# Altium project cameraFor4G.PrjPCB
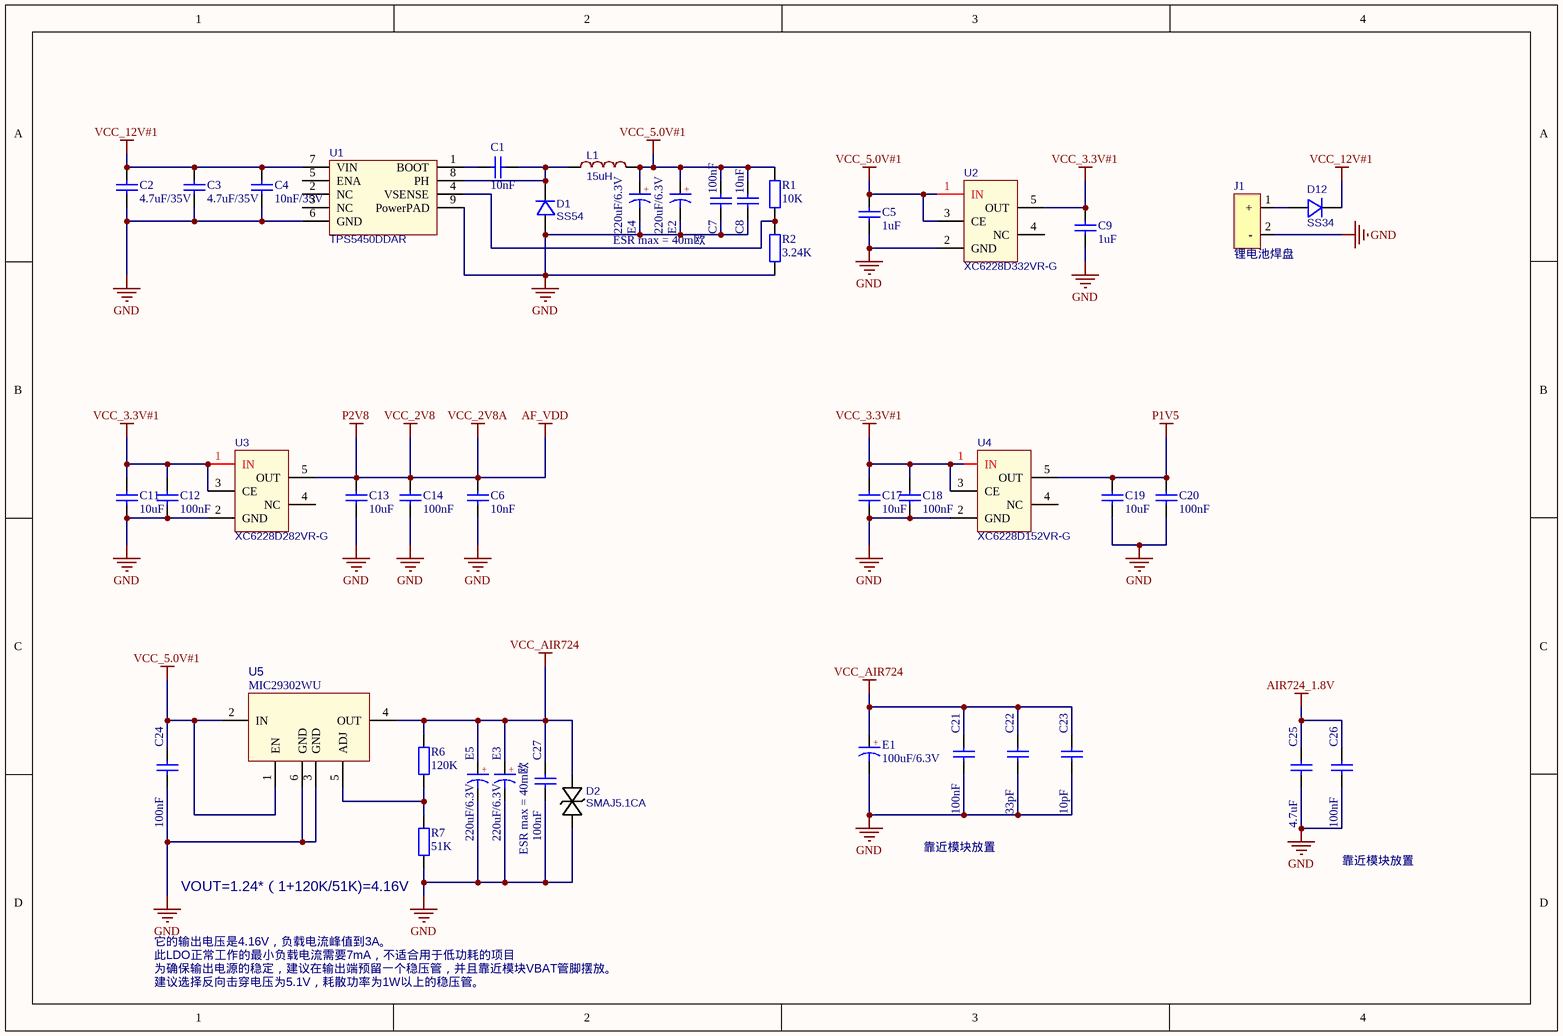
[diagram p0: 00_POWER.SchDoc]
5 sheets, 132 parts. Net scope: global (net labels, ports and power ports of the same name join across sheets).
Board file: cameraBoard.PcbDoc
Sheets:
  00_POWER.SchDoc
  01_MCU.SchDoc
  02_MCU_PERIPHERAL.SchDoc
  03_AIR724.SchDoc
  04_AIR724_PERIPHERAL.SchDoc

## Sheet 00_POWER.SchDoc
size A4

### Parts
C1  10nF  [0603-C]
C2  4.7uF/35V  [0805-C]
C3  4.7uF/35V  [0805-C]
C4  10nF/35V  [0603-C]
C5  1uF  [0603-C]
C6  10nF  [0603-C]
C7  100nF  [0603-C]
C8  10nF  [0603-C]
C9  1uF  [0603-C]
C11  10uF  [0603-C]
C12  100nF  [0603-C]
C13  10uF  [0603-C]
C14  100nF  [0603-C]
C17  10uF  [0603-C]
C18  100nF  [0603-C]
C19  10uF  [0603-C]
C20  100nF  [0603-C]
C21  100nF  [0603-C]
C22  33pF  [0603-C]
C23  10pF  [0603-C]
C24  100nF  [0603-C]
C25  4.7uF  [0603-C]
C26  100nF  [0603-C]
C27  100nF  [0603-C]
D1  SS54  [SS34-SMA]
D2  SMAJ5.1CA  [ZENER]
D12  SS34  [SS34-SMA]
E1  100uF/6.3V  [CD B(3528)]
E2  220uF/6.3V  [CD B(3528)]
E3  220uF/6.3V  [CD B(3528)]
E4  220uF/6.3V  [CD B(3528)]
E5  220uF/6.3V  [CD B(3528)]
J1  锂电池焊盘  [锂电池焊盘]
L1  15uH  [电感7*7*3]
R1  10K  [0603-R]
R2  3.24K  [0603-R]
R6  120K  [0603-R]
R7  51K  [0603-R]
U1  TPS5450DDAR  [TPS5430]
U2  XC6228D332VR-G  [XC6228D332VR-G]
U3  XC6228D282VR-G  [XC6228D332VR-G]
U4  XC6228D152VR-G  [XC6228D332VR-G]
U5  MIC29302WU  [MIC29302WU]

### Nets
AF_VDD: C6.2 C13.2 C14.2 U3.5(OUT)  [also labelled P2V8, VCC_2V8, VCC_2V8A]
AIR724_1.8V: C25.2 C26.2
GND: C2.2 C3.2 C4.1 C5.1 C6.1 C7.2 C8.2 C9.1 C11.1 C12.1 C13.1 C14.1 C17.1 C18.1 C19.1 C20.1 C21.1 C22.1 C23.1 C24.1 C25.1 C26.1 C27.1 D1.1(+) D2.2(A) E1.2(K) E2.2(K) E3.2(K) E4.2(K) E5.2(K) J1.2(-) R2.2 R7.2 U1.6(GND) U1.9(PowerPAD) U2.2(GND) U3.2(GND) U4.2(GND) U5.3(GND) U5.6(GND)
P1V5: C19.2 C20.2 U4.5(OUT)
VCC_3.3V#1: C9.2 C11.2 C12.2 C17.2 C18.2 U2.5(OUT) U3.1(IN) U3.3(CE) U4.1(IN) U4.3(CE)
VCC_5.0V#1: C5.2 C7.1 C8.1 C24.2 E2.1(A) E4.1(A) L1.2 R1.1 U2.1(IN) U2.3(CE) U5.1(EN) U5.2(IN)
VCC_12V#1: C2.1 C3.1 C4.2 D12.2(-) U1.7(VIN)
VCC_AIR724: C21.2 C22.2 C23.2 C27.2 D2.1(C) E1.1(A) E3.1(A) E5.1(A) R6.1 U5.4(OUT)
NetC1_1: C1.1 D1.2(-) L1.1 U1.8(PH)
NetC1_2: C1.2 U1.1(BOOT)
NetD12_1: D12.1(+) J1.1(+)
NetR1_2: R1.2 R2.1 U1.4(VSENSE)
NetR6_2: R6.2 R7.1 U5.5(ADJ)

Not connected (* = marked no-connect by the designer): U1 2(NC) 3(NC) 5(ENA); U2 4(NC); U3 4(NC); U4 4(NC)

### Notes on the sheet
- ESR max = 40m欧
- 靠近模块放置
- (near R7) VOUT=1.24*（1+120K/51K)=4.16V
- 它的输出电压是4.16V，负载电流峰值到3A。
- 为确保输出电源的稳定，建议在输出端预留一个稳压管，并且靠近模块VBAT管脚摆放。
- 建议选择反向击穿电压为5.1V，耗散功率为1W以上的稳压管。
- 此LDO正常工作的最小负载电流需要7mA，不适合用于低功耗的项目
- (in symbol CT) +

### Library data of the parts
C1-C9 C11-C14 C17-C27 = C: 贴片电容; BOM名称: 无极性贴片电容; 联系卖家，免费查找封装: 唯一出售店铺网址https://shop463601444.taobao.com
D1 D12 = SS34: BOM_Manufacturer: Wuxi ARK Tech Elec; BOM_Manufacturer Part: D-G060306G1-KS2; Contributor: LCSC; BOM_Supplier: LCSC; BOM_Supplier Part: C118334; BOM_JLCPCB Part Class: Extended Part; spicePre: L; spiceSymbolName: D-G060306G1-KS2
D2 = SMAJ6.0CA: SMAJ6.0CA_C698928; BOM_Manufacturer: Yangzhou Yangjie Elec Tech; Contributor: LCSC; BOM_Supplier: LCSC; BOM_Supplier Part: C698928; BOM_Manufacturer Part: SMAJ6.0CA; BOM_JLCPCB Part Class: Extended Part; spicePre: D; spiceSymbolName: SMAJ6.0CA_C698928
E1-E5 = CT: 贴片钽电容; 联系卖家，免费查找封装: 唯一出售店铺网址https://shop463601444.taobao.com; BOM名称: 贴片钽电容
L1 = L: BOM_Manufacturer: Sunlord; BOM_Manufacturer Part: UPZ2012D800-4R0TF; nameAlias: Value; Contributor: LCSC; BOM_Supplier: LCSC; BOM_Supplier Part: C145060; BOM_JLCPCB Part Class: Extended Part; spicePre: L; spiceSymbolName: UPZ2012D800-4R0TF
R1 R2 R6 R7 = R: 贴片电阻; 联系卖家，免费查找封装: 唯一出售店铺网址https://shop463601444.taobao.com; BOM名称: 贴片电阻
U1 = TPS5430DDAR: BOM_Manufacturer: TI; BOM_Supplier: LCSC; BOM_Manufacturer Part: TPS5430DDAR; BOM_Supplier Part: C9864; BOM_JLCPCB Part Class: Basic Part; spicePre: U; spiceSymbolName: TPS5430DDAR
U2 = XC6228D332VR-G: 输出类型：固定 输出极性：正 输出通道数：1 最大输入电压：5.5V 输出电压：3.3V 压差：305mV@(300mA) 输出电流：300mA 电源纹波抑制比(PSRR)：80dB@(1kHz) 3.3V固定输出，Iout=300mA，Vin=5.5V(Max); BOM_Manufacturer: TOREX; BOM_Supplier: LCSC; BOM_Manufacturer Part: XC6228D332VR-G; BOM_Supplier Part: C69841; BOM_JLCPCB Part Class: Extended Part; spicePre: U; spiceSymbolName: XC6228D332VR-G
U3 U4 = XC6228D282VR-G: 输出类型：固定 输出极性：正 输出通道数：1 最大输入电压：5.5V 输出电压：2.8V 压差：305mV@(300mA) 输出电流：300mA 电源纹波抑制比(PSRR)：80dB@(1kHz) 3.3V固定输出，Iout=300mA，Vin=5.5V(Max); BOM_Manufacturer: TOREX; BOM_Supplier: LCSC; BOM_Manufacturer Part: XC6228D332VR-G; BOM_Supplier Part: C69841; BOM_JLCPCB Part Class: Extended Part; spicePre: U; spiceSymbolName: XC6228D332VR-G
U5 = MIC29302WU: Manufacturer: UMW(友台半导体); Symbol: MIC29302WU_C2995533; Add into BOM: yes; Name: MIC29302WU; Device: MIC29302WU; LCSC Part Name: 3A Fast-Response LDO Regulator; Supplier Part: C2995533; Manufacturer Part: MIC29302WU; Supplier Footprint: TO-263; JLCPCB Part Class: Extended Part; Datasheet: https://atta.szlcsc.com/upload/public/pdf/source/20220414/64A379364ACD2069C59BD188E91B8798.pdf; Supplier: LCSC; Convert to PCB: yes

## Sheet 01_MCU.SchDoc
size A4
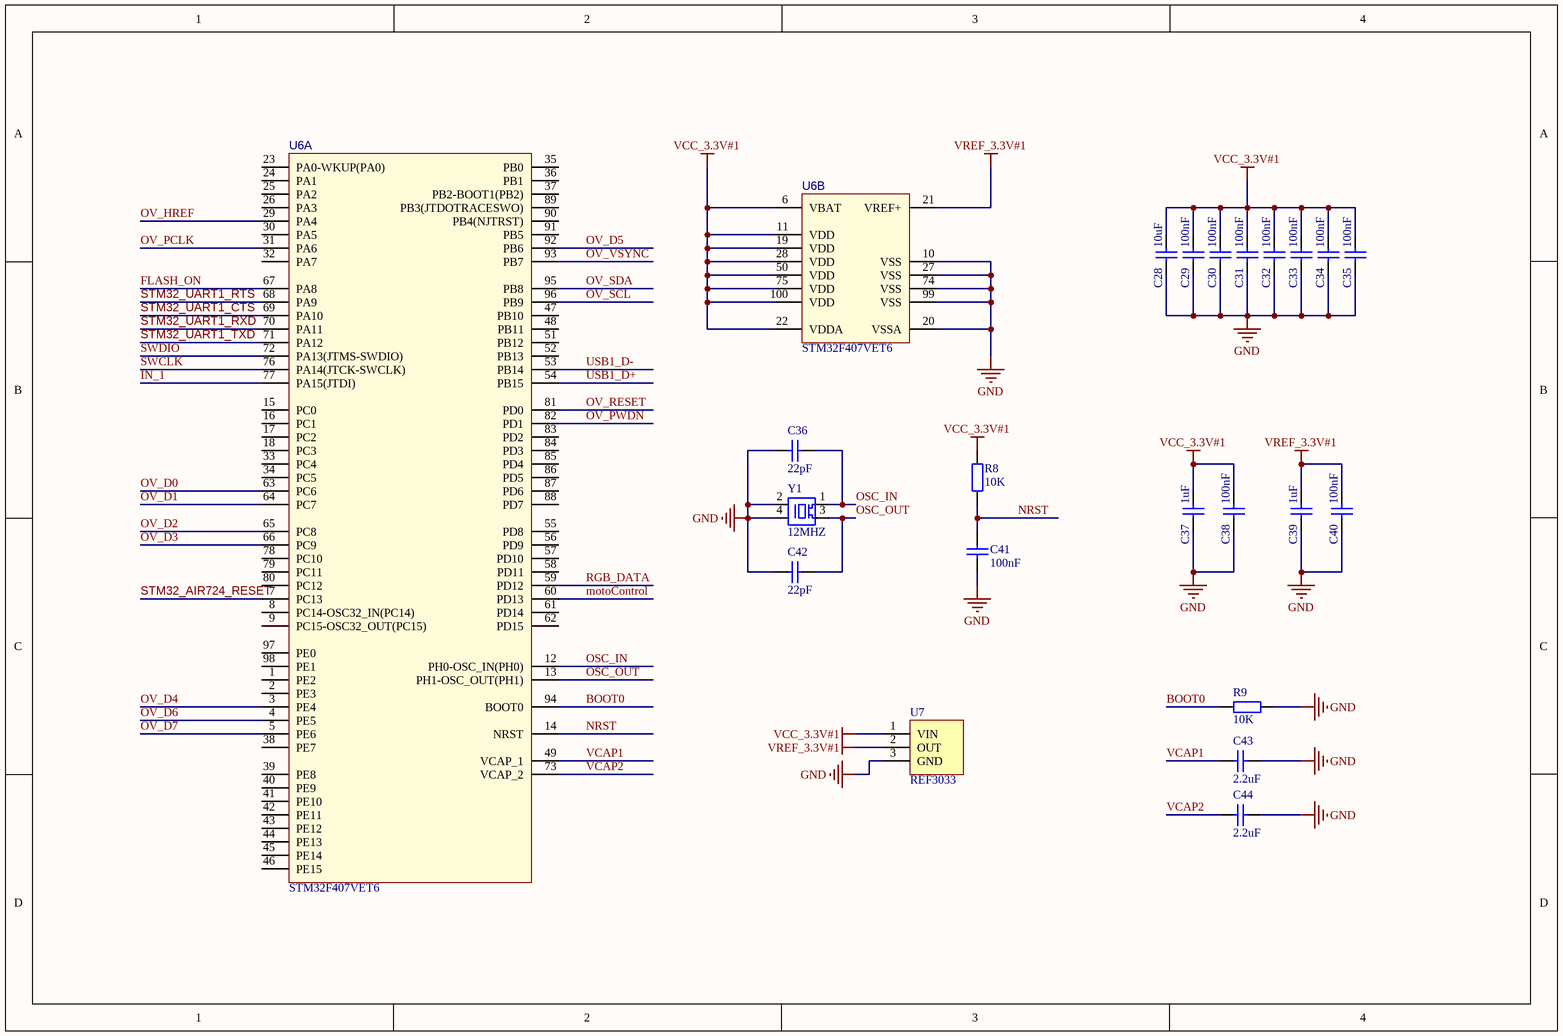
[diagram p1: 01_MCU.SchDoc]

### Parts
C28  10uF  [0603-C]
C29  100nF  [0603-C]
C30  100nF  [0603-C]
C31  100nF  [0603-C]
C32  100nF  [0603-C]
C33  100nF  [0603-C]
C34  100nF  [0603-C]
C35  100nF  [0603-C]
C36  22pF  [0603-C]
C37  1uF  [0603-C]
C38  100nF  [0603-C]
C39  1uF  [0603-C]
C40  100nF  [0603-C]
C41  100nF  [0603-C]
C42  22pF  [0603-C]
C43  2.2uF  [0603-C]
C44  2.2uF  [0603-C]
R8  10K  [0603-R]
R9  10K  [0603-R]
U6  STM32F407VET6  [STM32F407VET6]  (parts A,B of 2)
U7  REF3033  [REF3033]
Y1  12MHZ  [3225]

### Nets
GND: C28.1 C29.1 C30.1 C31.1 C32.1 C33.1 C34.1 C35.1 C36.1 C37.1 C38.1 C39.1 C40.1 C41.1 C42.1 C43.2 C44.2 R9.1 U6.10(VSS) U6.20(VSSA) U6.27(VSS) U6.74(VSS) U6.99(VSS) U7.3(GND) Y1.2(GND) Y1.4(GND)
VCC_3.3V#1: C28.2 C29.2 C30.2 C31.2 C32.2 C33.2 C34.2 C35.2 C37.2 C38.2 R8.2 U6.6(VBAT) U6.11(VDD) U6.19(VDD) U6.22(VDDA) U6.28(VDD) U6.50(VDD) U6.75(VDD) U6.100(VDD) U7.1(VIN)
VREF_3.3V#1: C39.2 C40.2 U6.21(VREF+) U7.2(OUT)
BOOT0: R9.2 U6.94(BOOT0)
FLASH_ON: U6.67(PA8)
IN_1: U6.77(PA15(JTDI))
motoControl: U6.60(PD13)
NRST: C41.2 R8.1 U6.14(NRST)
OSC_IN: C36.2 U6.12(PH0-OSC_IN(PH0)) Y1.1(XTAL1)
OSC_OUT: C42.2 U6.13(PH1-OSC_OUT(PH1)) Y1.3(XTAL3)
OV_D0: U6.63(PC6)
OV_D1: U6.64(PC7)
OV_D2: U6.65(PC8)
OV_D3: U6.66(PC9)
OV_D4: U6.3(PE4)
OV_D5: U6.92(PB6)
OV_D6: U6.4(PE5)
OV_D7: U6.5(PE6)
OV_HREF: U6.29(PA4)
OV_PCLK: U6.31(PA6)
OV_PWDN: U6.82(PD1)
OV_RESET: U6.81(PD0)
OV_SCL: U6.96(PB9)
OV_SDA: U6.95(PB8)
OV_VSYNC: U6.93(PB7)
RGB_DATA: U6.59(PD12)
STM32_AIR724_RESET: U6.7(PC13)
STM32_UART1_CTS: U6.69(PA10)
STM32_UART1_RTS: U6.68(PA9)
STM32_UART1_RXD: U6.70(PA11)
STM32_UART1_TXD: U6.71(PA12)
SWCLK: U6.76(PA14(JTCK-SWCLK))
SWDIO: U6.72(PA13(JTMS-SWDIO))
USB1_D+: U6.54(PB15)
USB1_D-: U6.53(PB14)
VCAP1: C43.1 U6.49(VCAP_1)
VCAP2: C44.1 U6.73(VCAP_2)

Not connected (* = marked no-connect by the designer): U6 1(PE2) 2(PE3) 8(PC14-OSC32_IN(PC14)) 9(PC15-OSC32_OUT(PC15)) 15(PC0) 16(PC1) 17(PC2) 18(PC3) 23(PA0-WKUP(PA0)) 24(PA1) 25(PA2) 26(PA3) 30(PA5) 32(PA7) 33(PC4) 34(PC5) 35(PB0) 36(PB1) 37(PB2-BOOT1(PB2)) 38(PE7) 39(PE8) 40(PE9) 41(PE10) 42(PE11) 43(PE12) 44(PE13) 45(PE14) 46(PE15) 47(PB10) 48(PB11) 51(PB12) 52(PB13) 55(PD8) 56(PD9) 57(PD10) 58(PD11) 61(PD14) 62(PD15) 78(PC10) 79(PC11) 80(PC12) 83(PD2) 84(PD3) 85(PD4) 86(PD5) 87(PD6) 88(PD7) 89(PB3(JTDOTRACESWO)) 90(PB4(NJTRST)) 91(PB5) 97(PE0) 98(PE1)

### Library data of the parts
C28-C44 = C: as C1 on sheet 00_POWER
R8 R9 = R: as R1 on sheet 00_POWER; BOM名称: 贴片电阻
U6 = STM32F407VET6: Manufacturer: ST(意法半导体); Add into BOM: yes; CPU Core: ARM Cortex-M4; CPU Maximum Speed: 168MHz; Operating Voltage Range: 1.8V~3.6V; Program Storage Size: 512KB; Program Memory Type: FLASH; RAM Size: 192KB; GPIO Ports Number: 82; ADC (Bit): 12bit; Universal Serial Bus: 有; Peripheral/Function: DMA；LCD/LED驱动；PWM; tags: STM32; Name: STM32F407VET6; Symbol: STM32F407VET6; Device: STM32F407VET6; LCSC Part Name: STM32F407VET6; Supplier Part: C28730; Manufacturer Part: STM32F407VET6; Supplier Footprint: LQFP-100(14x14); JLCPCB Part Class: Extended Part; Datasheet: https://atta.szlcsc.com/upload/public/pdf/source/20140801/1457707197138.pdf; Supplier: LCSC; Convert to PCB: yes; EEPROM: -; DAC (Bit): 12bit; PWM (Bit): -; Internal Comparator: -; communication protocol: -; Watchdog: 有; Real-Time Clock: -; Infrared Data Association: 有; Low-Voltage Detect: 有; CCP Capture/Compare: -; LCD Module: 有; Secure Digital Input and Output: -; Direct Memory Access: 有; Internal Oscillator: 有; Operating Temperature Range: -40℃~+85℃; image: http://image.lceda.cn/szlcsc/C28730.jpg
Y1 = Y: 无源晶振

## Sheet 02_MCU_PERIPHERAL.SchDoc
size A4
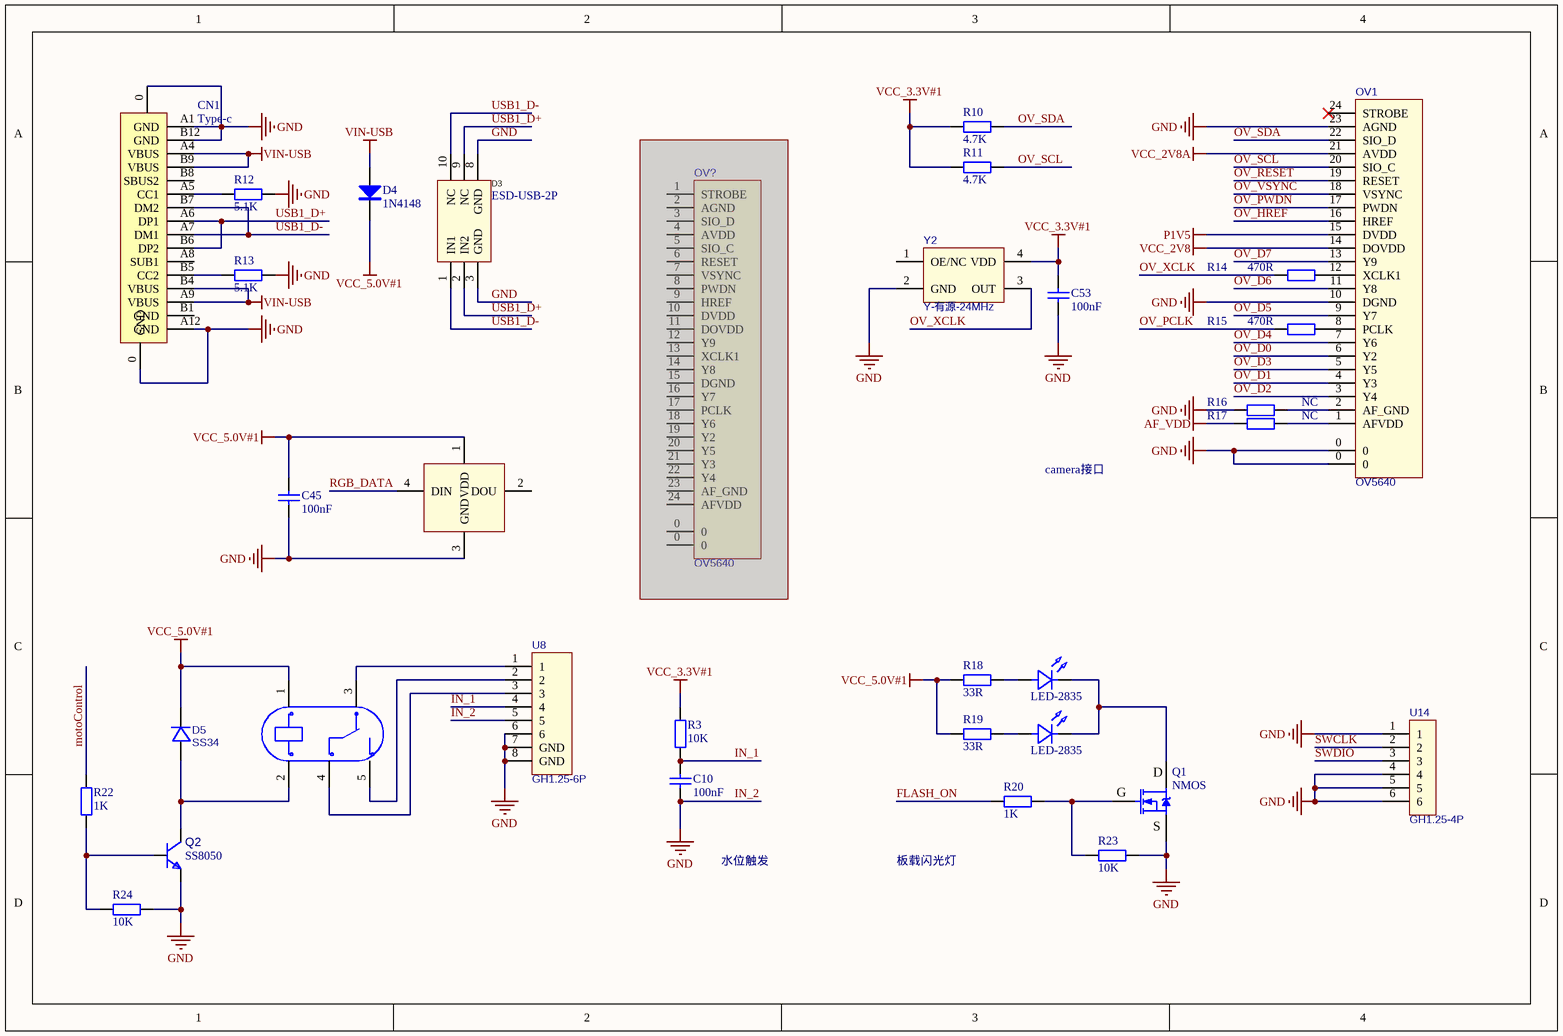
[diagram p2: 02_MCU_PERIPHERAL.SchDoc]

### Parts
C10  100nF  [0603-C]
C45  100nF  [0603-C]
C53  100nF  [0603-C]
CN1  Type-c  [Type-c 16pin]
D3  ESD-USB-2P  [SLP2510P8-2P]
D4  1N4148  [1N4148W]
D5  SS34  [SS34-SMA]
K1  JQC-3FF/005-1ZS(551)  [RELAY-TH_HF3FF-XX-1ZXX-XXX]  (value not drawn)
LED1  WS2812B-5050  [WS2812B-5050]  (value not drawn)
OV1  OV5640  [FPC-SMD_P0.50-24P_XJ-FGS]
OV?  OV5640  [FPC-SMD_P0.50-24P_XJ-FGS]  (masked out: inside a compile mask, not in the netlist)
Q1  NMOS  [AO3400]
Q2  SS8050  [SOT23-3M]
R3  10K  [0603-R]
R10  4.7K  [0603-R]
R11  4.7K  [0603-R]
R12  5.1K  [0603-R]
R13  5.1K  [0603-R]
R14  470R  [0603-R]
R15  470R  [0603-R]
R16  NC  [0603-R]
R17  NC  [0603-R]
R18  33R  [1206-R]
R19  33R  [1206-R]
R20  1K  [0603-R]
R22  1K  [0603-R]
R23  10K  [0603-R]
R24  10K  [0603-R]
U8  GH1.25-6P  [CONN-SMD_A1257WR-S-6P]
U9  LED-2835  [LED-SMD_L3.5-W2.8-FD-2835_WHITE]
U10  LED-2835  [LED-SMD_L3.5-W2.8-FD-2835_WHITE]
U14  GH1.25-4P  [CONN-SMD_GH1.25-4PWBPZ]
Y2  Y-有源-24MHz  [3225]

### Nets
AF_VDD: OV1.14(DOVDD) OV1.21(AVDD) R17.2  [also labelled VCC_2V8, VCC_2V8A]
GND: C10.1 C45.1 C53.1 CN1.0(GND) CN1.A1(GND) CN1.A12(GND) CN1.B12(GND) D3.3(GND) D3.8(GND) LED1.3(GND) OV1.0 OV1.10(DGND) OV1.23(AGND) Q1.2(S) Q2.2(E) R12.2 R13.2 R16.2 R23.1 R24.1 U8.5 U8.6 U8.7(GND) U8.8(GND) U14.1 U14.4 U14.5 U14.6 Y2.2(GND)  [also labelled IN_2]
P1V5: OV1.15(DVDD)
VCC_3.3V#1: C53.2 R3.2 R10.2 R11.2 Y2.4(VDD)
VCC_5.0V#1: C45.2 D4.2(K) D5.2(-) K1.1 LED1.1(VDD) R18.2 R19.2
VIN-USB: CN1.A4(VBUS) CN1.A9(VBUS) CN1.B4(VBUS) CN1.B9(VBUS) D4.1(A)
FLASH_ON: R20.2
IN_1: C10.2 R3.1 U8.4
motoControl: R22.2
OV_D0: OV1.6(Y2)
OV_D1: OV1.4(Y3)
OV_D2: OV1.3(Y4)
OV_D3: OV1.5(Y5)
OV_D4: OV1.7(Y6)
OV_D5: OV1.9(Y7)
OV_D6: OV1.11(Y8)
OV_D7: OV1.13(Y9)
OV_HREF: OV1.16(HREF)
OV_PCLK: R15.2
OV_PWDN: OV1.17(PWDN)
OV_RESET: OV1.19(RESET)
OV_SCL: OV1.20(SIO_C) R11.1
OV_SDA: OV1.22(SIO_D) R10.1
OV_VSYNC: OV1.18(VSYNC)
OV_XCLK: R14.2 Y2.3(OUT)
RGB_DATA: LED1.4(DIN)
SWCLK: U14.2
SWDIO: U14.3
USB1_D+: CN1.A6(DP1) CN1.B6(DP2) D3.2(IN2) D3.9(NC)
USB1_D-: CN1.A7(DM1) CN1.B7(DM2) D3.1(IN1) D3.10(NC)
NetCN1_A5: CN1.A5(CC1) R12.1
NetCN1_B5: CN1.B5(CC2) R13.1
NetD5_1: D5.1(+) K1.2 Q2.3(C)
NetK1_3: K1.3 U8.1
NetK1_4: K1.4 U8.3
NetK1_5: K1.5 U8.2
NetOV1_1: OV1.1(AFVDD) R17.1
NetOV1_2: OV1.2(AF_GND) R16.1
NetOV1_8: OV1.8(PCLK) R15.1
NetOV1_12: OV1.12(XCLK1) R14.1
NetQ1_1: Q1.1(G) R20.1 R23.2
NetQ1_3: Q1.3(D) U9.1(K) U10.1(K)
NetQ2_1: Q2.1(B) R22.1 R24.2
NetR18_1: R18.1 U9.2(A)
NetR19_1: R19.1 U10.2(A)

Not connected (* = marked no-connect by the designer): CN1 A8(SUB1) B1(GND) B8(SBUS2); LED1 2(DOU); OV1 24(STROBE)*; Y2 1(OE/NC)

### Notes on the sheet
- camera接口
- 水位触发
- 板载闪光灯

### Library data of the parts
C10 C45 C53 = C: as C1 on sheet 00_POWER
CN1 = Type-c: U262-161N-4BVC11
D3 = ESD-USB-2P: RClamp0522PATCT; Manufacturer: SEMTECH; Name: RClamp0524PATCT; Device: RClamp0524PATCT_C40960; Add into BOM: yes; Reverse Stand-Off Voltage (Vrwm): 5V; Breakdown Voltage (VBR): 6V; Clamping Voltage@Ipp: 15V; Peak Pulse Power(Ppp)@8/20us: 150W; Junction Capacitance(Cj)@1MHz: 0.8pF@1MHz; Symbol: RClamp0524PATCT; LCSC Part Name: RClamp0524PATCT; Supplier Part: C40960; Manufacturer Part: RClamp0524PATCT; Supplier Footprint: SLP2510P8; JLCPCB Part Class: Extended Part; Datasheet: https://atta.szlcsc.com/upload/public/pdf/source/20150124/1457707260739.pdf; Supplier: LCSC; Convert to PCB: yes; Operating Temperature: -55℃~+125℃@(Tj)
D4 = 1N4148W: 整流二极管; 版权归属: 源创客; BOM名称: 整流二极管; 学习资源: www.ooocke.com
D5 = SS34: as D1 on sheet 00_POWER; BOM_Supplier: LCSC; BOM_Supplier Part: C118334; BOM_JLCPCB Part Class: Extended Part; spicePre: L; spiceSymbolName: D-G060306G1-KS2
K1 = JQC-3FF/005-1ZS(551): Manufacturer: HF(宏发); Symbol: JQC-3FF/05-1ZS(551); Add into BOM: yes; Coil Voltage: 5V; Coil Type: 非极化-单线圈; Pin Number: 5; Contact Form: 一组转换:1C(单刀双掷-转换); Maximum Switching Current: 10A; Maximum Switching Voltage: 277V@AC；30V@DC; Coil Rated Power: 360mW; Contact Rating: 10A@28VDC；10A@277VAC; Coil Resistance: 70Ω; Operate Time: 10ms; Release Time: 5ms; Contact Resistance: 100mΩ; Name: JQC-3FF/005-1ZS(551); Device: JQC-3FF/005-1ZS(551); LCSC Part Name: 超小型大功率5V继电器 单刀双掷; Supplier Part: C9221; Manufacturer Part: JQC-3FF/005-1ZS(551); Supplier Footprint: 插件,15.5x19mm; JLCPCB Part Class: Extended Part; Datasheet: https://atta.szlcsc.com/upload/public/pdf/source/20210906/31FD0911648F640D4227475E890A46EB.pdf; Supplier: LCSC; Convert to PCB: yes; Contact Material: AgCdO; Operating Temperature: -40℃~+85℃
LED1 = WS2812B-5050: Manufacturer: XINGLIGHT(成兴光); Name: XL-5050RGBC-WS2812B; Add into BOM: yes; Emitted Color: RGB三色; Lens Color: 无色透明; Peak Wavelength: 625nm；470nm；530nm; Viewing Angle: 120°; Mounting Sytle: 正贴; Symbol: XL-5050RGBC-WS2812B; Device: XL-5050RGBC-WS2812B; LCSC Part Name: RGB三色 正贴 幻彩; Supplier Part: C2843785; Manufacturer Part: XL-5050RGBC-WS2812B; Supplier Footprint: SMD5050; JLCPCB Part Class: Extended Part; Datasheet: https://atta.szlcsc.com/upload/public/pdf/source/20230111/86AAD2096485A2E5BCAB883FF8CBE6FD.pdf; Supplier: LCSC; Convert to PCB: yes; Diode Configuration: -; Dominant Wavelength: -; Color Temperature: -; Forward Current: -; Power Dissipation: -; Operating Temperature: -30℃~+70℃
OV1 = OV5640_BACK: BOM_Manufacturer: Shenzhen Cankemeng; Contributor: LCSC; BOM_Supplier: LCSC; BOM_Supplier Part: C132514; BOM_Manufacturer Part: -; BOM_JLCPCB Part Class: Extended Part; spicePre: F; spiceSymbolName: FPC0.5-24P
OV? = OV5640: BOM_Manufacturer: Shenzhen Cankemeng; Contributor: LCSC; BOM_Supplier: LCSC; BOM_Supplier Part: C132514; BOM_Manufacturer Part: -; BOM_JLCPCB Part Class: Extended Part; spicePre: F; spiceSymbolName: FPC0.5-24P
Q1 = AO3400: N沟道 30V/4.2A; BOM名称: 场效应管; 联系卖家，免费查找封装: 唯一出售店铺网址https://shop463601444.taobao.com; 参数: N沟道 30V/4.2A
R3 R10-R20 R22-R24 = R: as R1 on sheet 00_POWER; BOM名称: 贴片电阻
U8 = GH1.25-6P: GH1.25-4PWBPZ; BOM_Manufacturer: BOOMELE(博穆精密); Contributor: LCSC; BOM_Supplier: LCSC; BOM_Supplier Part: C2829253; BOM_Manufacturer Part: GH1.25-4PWBPZ; spicePre: U; spiceSymbolName: GH1.25-4PWBPZ
U9 U10 = LED-2835: Manufacturer: HONGLITRONIC(鸿利光电); Name: A2835W3H2-D01-8D2AB5; Add into BOM: yes; Symbol: A2835W3H2-D01-8D2AB5; Device: A2835W3H2-D01-8D2AB5; LCSC Part Name: 2835自然白3800-4250K 高性价比; Supplier Part: C7423445; Manufacturer Part: A2835W3H2-D01-8D2AB5; Supplier Footprint: 2835; JLCPCB Part Class: Extended Part; Datasheet: https://atta.szlcsc.com/upload/public/pdf/source/20230608/811871640B6DA35415197D15B0ECD5AB.pdf; Supplier: LCSC; Convert to PCB: yes
U14 = GH1.25-4P: GH1.25-4PWBPZ; BOM_Manufacturer: BOOMELE(博穆精密); Contributor: LCSC; BOM_Supplier: LCSC; BOM_Supplier Part: C2829253; BOM_Manufacturer Part: GH1.25-4PWBPZ; spicePre: U; spiceSymbolName: GH1.25-4PWBPZ
Y2 = Y-有源: 有源晶振; BOM_Manufacturer: YXC扬兴科技; BOM_Manufacturer Part: OT322540MJBA4SL; nameAlias: Frequency; Contributor: LCSC; BOM_Supplier: LCSC; BOM_Supplier Part: C2831396; BOM_JLCPCB Part Class: Extended Part; spicePre: X; spiceSymbolName: OT322540MJBA4SL

## Sheet 03_AIR724.SchDoc
size A4
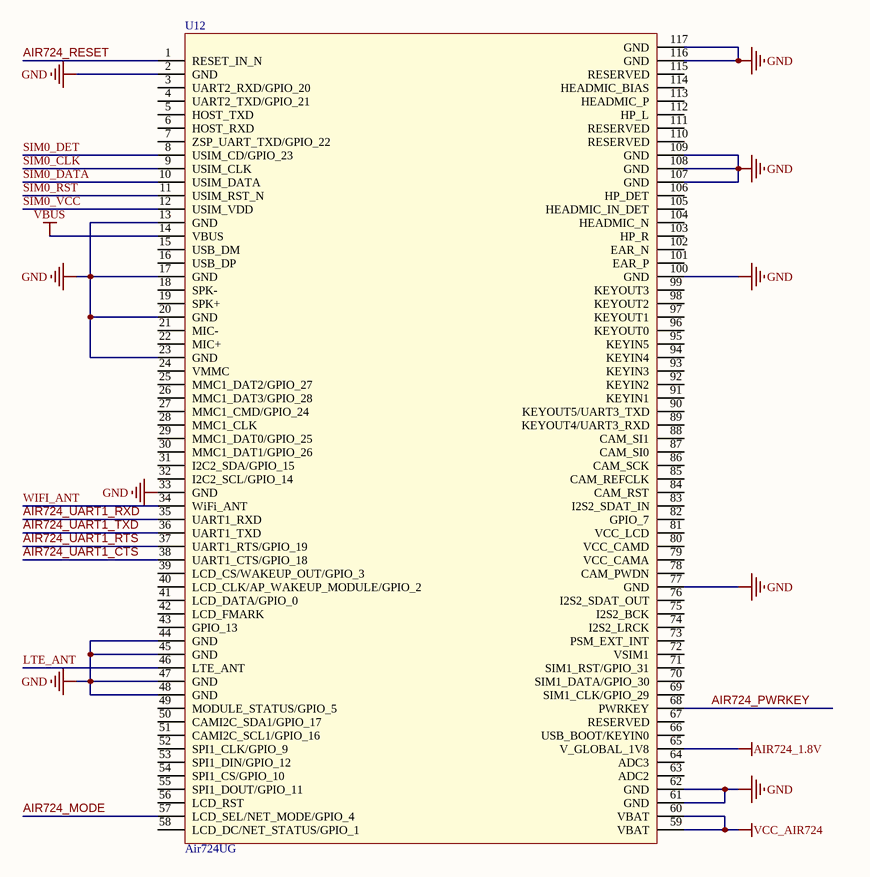
[diagram p3: 03_AIR724.SchDoc]

### Parts
U12  Air724UG  [AIR724UG]

### Nets
AIR724_1.8V: U12.65(V_GLOBAL_1V8)
GND: U12.2(GND) U12.13(GND) U12.17(GND) U12.20(GND) U12.23(GND) U12.33(GND) U12.44(GND) U12.45(GND) U12.47(GND) U12.48(GND) U12.61(GND) U12.62(GND) U12.77(GND) U12.100(GND) U12.107(GND) U12.108(GND) U12.109(GND) U12.116(GND) U12.117(GND)
VBUS: U12.14(VBUS)
VCC_AIR724: U12.59(VBAT) U12.60(VBAT)
AIR724_MODE: U12.57(LCD_SEL/NET_MODE/GPIO_4)
AIR724_PWRKEY: U12.68(PWRKEY)
AIR724_RESET: U12.1(RESET_IN_N)
AIR724_UART1_CTS: U12.38(UART1_CTS/GPIO_18)
AIR724_UART1_RTS: U12.37(UART1_RTS/GPIO_19)
AIR724_UART1_RXD: U12.35(UART1_RXD)
AIR724_UART1_TXD: U12.36(UART1_TXD)
LTE_ANT: U12.46(LTE_ANT)
SIM0_CLK: U12.9(USIM_CLK)
SIM0_DATA: U12.10(USIM_DATA)
SIM0_DET: U12.8(USIM_CD/GPIO_23)
SIM0_RST: U12.11(USIM_RST_N)
SIM0_VCC: U12.12(USIM_VDD)
WIFI_ANT: U12.34(WiFi_ANT)

Not connected (* = marked no-connect by the designer): U12 3(UART2_RXD/GPIO_20) 4(UART2_TXD/GPIO_21) 5(HOST_TXD) 6(HOST_RXD) 7(ZSP_UART_TXD/GPIO_22) 15(USB_DM) 16(USB_DP) 18(SPK-) 19(SPK+) 21(MIC-) 22(MIC+) 24(VMMC) 25(MMC1_DAT2/GPIO_27) 26(MMC1_DAT3/GPIO_28) 27(MMC1_CMD/GPIO_24) 28(MMC1_CLK) 29(MMC1_DAT0/GPIO_25) 30(MMC1_DAT1/GPIO_26) 31(I2C2_SDA/GPIO_15) 32(I2C2_SCL/GPIO_14) 39(LCD_CS/WAKEUP_OUT/GPIO_3) 40(LCD_CLK/AP_WAKEUP_MODULE/GPIO_2) 41(LCD_DATA/GPIO_0) 42(LCD_FMARK) 43(GPIO_13) 49(MODULE_STATUS/GPIO_5) 50(CAMI2C_SDA1/GPIO_17) 51(CAMI2C_SCL1/GPIO_16) 52(SPI1_CLK/GPIO_9) 53(SPI1_DIN/GPIO_12) 54(SPI1_CS/GPIO_10) 55(SPI1_DOUT/GPIO_11) 56(LCD_RST) 58(LCD_DC/NET_STATUS/GPIO_1) 63(ADC2) 64(ADC3) 66(USB_BOOT/KEYIN0) 67(RESERVED) 69(SIM1_CLK/GPIO_29) 70(SIM1_DATA/GPIO_30) 71(SIM1_RST/GPIO_31) 72(VSIM1) 73(PSM_EXT_INT) 74(I2S2_LRCK) 75(I2S2_BCK) 76(I2S2_SDAT_OUT) 78(CAM_PWDN) 79(VCC_CAMA) 80(VCC_CAMD) 81(VCC_LCD) 82(GPIO_7) 83(I2S2_SDAT_IN) 84(CAM_RST) 85(CAM_REFCLK) 86(CAM_SCK) 87(CAM_SI0) 88(CAM_SI1) 89(KEYOUT4/UART3_RXD) 90(KEYOUT5/UART3_TXD) 91(KEYIN1) 92(KEYIN2) 93(KEYIN3) 94(KEYIN4) 95(KEYIN5) 96(KEYOUT0) 97(KEYOUT1) 98(KEYOUT2) 99(KEYOUT3) 101(EAR_P) 102(EAR_N) 103(HP_R) 104(HEADMIC_N) 105(HEADMIC_IN_DET) 106(HP_DET) 110(RESERVED) 111(RESERVED) 112(HP_L) 113(HEADMIC_P) 114(HEADMIC_BIAS) 115(RESERVED)

### Library data of the parts
U12 = Air724UG: Manufacturer: Luat(合宙); Symbol: AIR724UG-NA; Add into BOM: yes; Device: Air724UG-NA; LCSC Part Name: 合宙Luat 4G Cat.1模组Air724UG; Supplier Part: C559028; Manufacturer Part: Air724UG-NA; Supplier Footprint: SMD; JLCPCB Part Class: 扩展库; Supplier: LCSC; Convert to PCB: yes

## Sheet 04_AIR724_PERIPHERAL.SchDoc
size A4
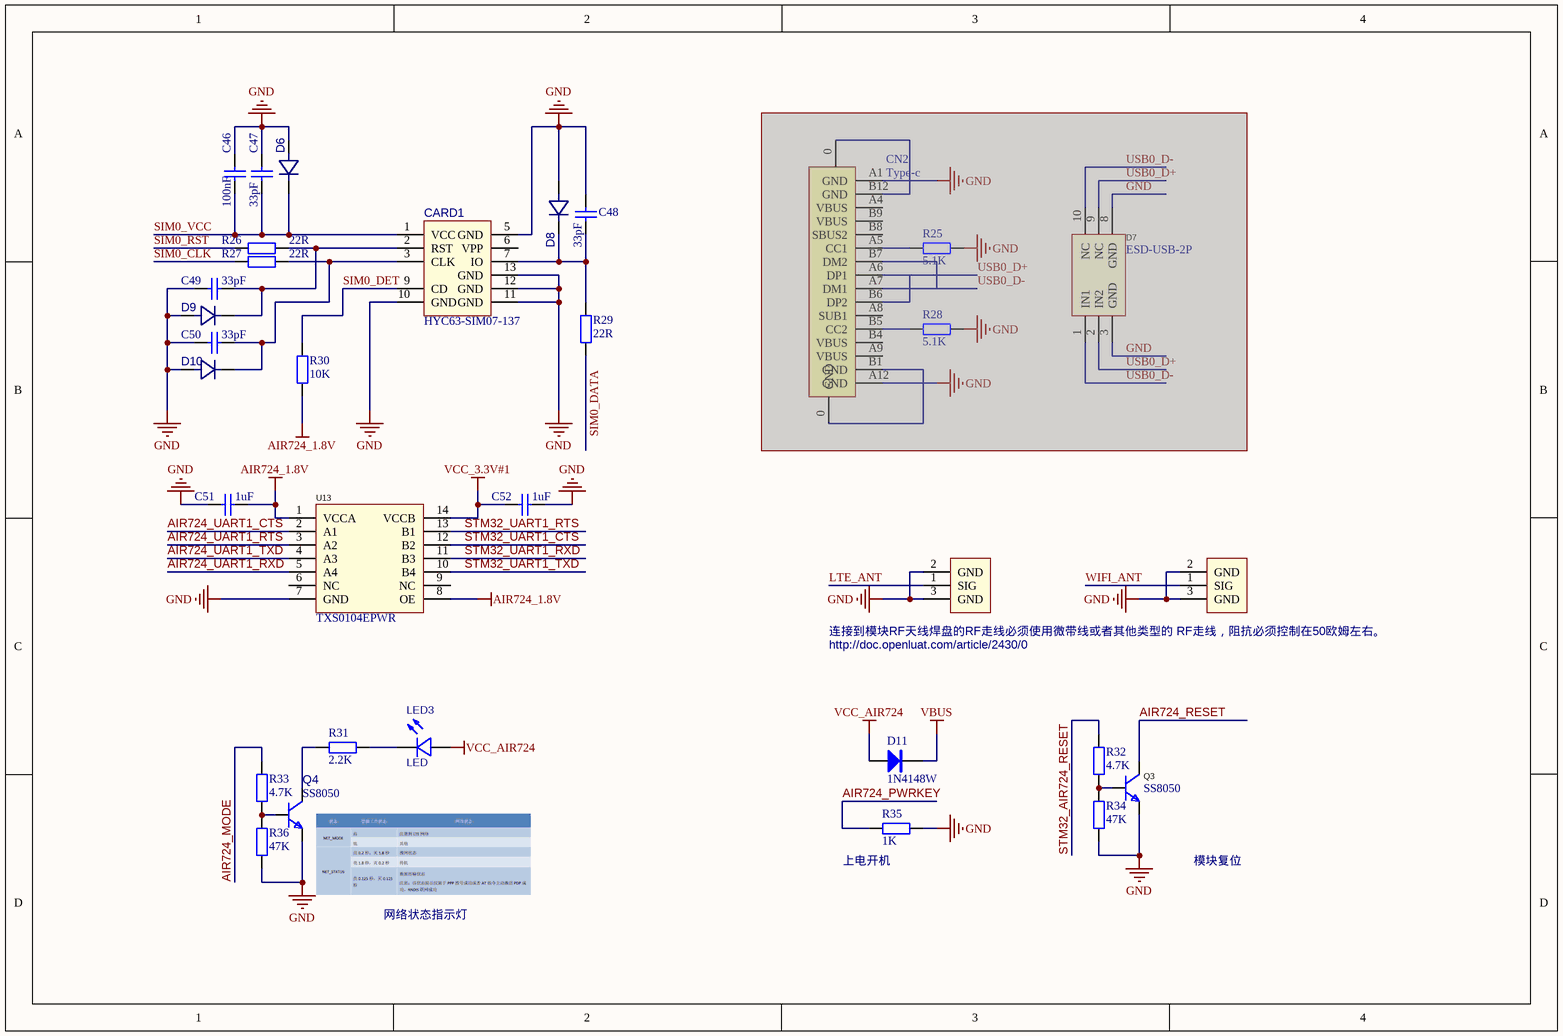
[diagram p4: 04_AIR724_PERIPHERAL.SchDoc]

### Parts
C46  100nF  [0603-C]
C47  33pF  [0603-C]
C48  33pF  [0603-C]
C49  33pF  [0603-C]
C50  33pF  [0603-C]
C51  1uF  [0603-C]
C52  1uF  [0603-C]
CARD1  HYC63-SIM07-137  [NANO-SIM-SMD_HYC63-SIM07-137]
CN2  Type-c  [Type-c 16pin]  (masked out: inside a compile mask, not in the netlist)
D6  ESD9X5.0ST5G  [ESD9X5.0ST5G]  (value not drawn)
D7  ESD-USB-2P  [SLP2510P8-2P]  (masked out: inside a compile mask, not in the netlist)
D8  ESD9X5.0ST5G  [ESD9X5.0ST5G]  (value not drawn)
D9  ESD9X5.0ST5G  [ESD9X5.0ST5G]  (value not drawn)
D10  ESD9X5.0ST5G  [ESD9X5.0ST5G]  (value not drawn)
D11  1N4148W  [1N4148W]
LED3  LED  [LED-0603]
Q3  SS8050  [SOT23-3M]
Q4  SS8050  [SOT23-3M]
R25  5.1K  [0603-R]  (masked out: inside a compile mask, not in the netlist)
R26  22R  [0603-R]
R27  22R  [0603-R]
R28  5.1K  [0603-R]  (masked out: inside a compile mask, not in the netlist)
R29  22R  [0603-R]
R30  10K  [0603-R]
R31  2.2K  [0603-R]
R32  4.7K  [0603-R]
R33  4.7K  [0603-R]
R34  47K  [0603-R]
R35  1K  [0603-R]
R36  47K  [0603-R]
RF1  IPEX  [IPEX-SMD-1代]  (value not drawn)
RF2  IPEX  [IPEX-SMD-1代]  (value not drawn)
U13  TXS0104EPWR  [TXS0104EPWR]

### Nets
AIR724_1.8V: C51.1 R30.1 U13.1(VCCA) U13.8(OE)
GND: C46.2 C47.2 C48.2 C49.2 C50.2 C51.2 C52.1 CARD1.5(GND) CARD1.10(GND) CARD1.11(GND) CARD1.12(GND) CARD1.13(GND) D6.2(A) D8.2(A) D9.2(A) D10.2(A) Q3.2(E) Q4.2(E) R34.1 R35.1 R36.1 RF1.2(GND) RF1.3(GND) RF2.2(GND) RF2.3(GND) U13.7(GND)
VBUS: D11.2(K)
VCC_3.3V#1: C52.2 U13.14(VCCB)
VCC_AIR724: D11.1(A) LED3.2(+)
AIR724_MODE: R33.2
AIR724_PWRKEY: R35.2
AIR724_RESET: Q3.3(C)
AIR724_UART1_CTS: U13.2(A1)
AIR724_UART1_RTS: U13.3(A2)
AIR724_UART1_RXD: U13.5(A4)
AIR724_UART1_TXD: U13.4(A3)
LTE_ANT: RF1.1(SIG)
SIM0_CLK: R27.1
SIM0_DATA: R29.1
SIM0_DET: CARD1.9(CD) R30.2
SIM0_RST: R26.1
SIM0_VCC: C46.1 C47.1 CARD1.1(VCC) D6.1(K)
STM32_AIR724_RESET: R32.2
STM32_UART1_CTS: U13.12(B2)
STM32_UART1_RTS: U13.13(B1)
STM32_UART1_RXD: U13.11(B3)
STM32_UART1_TXD: U13.10(B4)
WIFI_ANT: RF2.1(SIG)
NetC48_1: C48.1 CARD1.7(IO) D8.1(K) R29.2
NetC49_1: C49.1 CARD1.2(RST) D9.1(K) R26.2
NetC50_1: C50.1 CARD1.3(CLK) D10.1(K) R27.2
NetLED3_1: LED3.1(-) R31.1
NetQ3_1: Q3.1(B) R32.1 R34.2
NetQ4_1: Q4.1(B) R33.1 R36.2
NetQ4_3: Q4.3(C) R31.2

Not connected (* = marked no-connect by the designer): CARD1 6(VPP); U13 6(NC) 9(NC)

### Notes on the sheet
- (near RF1) 连接到模块RF天线焊盘的RF走线必须使用微带线或者其他类型的 RF走线，阻抗必须控制在50欧姆左右。
- (near RF1) http://doc.openluat.com/article/2430/0
- 网络状态指示灯
- (near R35) 上电开机
- 模块复位

### Library data of the parts
C46-C52 = C: as C1 on sheet 00_POWER
CARD1 = NanoSIM卡座: 自弹式 NanoSIM卡 卡座 带CD PIN 带柱; Manufacturer: 华宇创; Add into BOM: yes; Body Height (Max): 1.25mm; Name: HYC63-SIM07-137; Symbol: HYC63-SIM07-137; Device: HYC63-SIM07-137; LCSC Part Name: 自弹式 NanoSIM卡 卡座 带CD PIN 带柱; Supplier Part: C645507; Manufacturer Part: HYC63-SIM07-137; Supplier Footprint: SMD; JLCPCB Part Class: Extended Part; Datasheet: https://atta.szlcsc.com/upload/public/pdf/source/20200616/C645507_89E3671A4105357B007331596DCB72F5.pdf; Supplier: LCSC; Convert to PCB: yes; Card Connection Mode: 自弹式; Card Type: NanoSIM卡; Connector Type: 卡座; Contact Material: -; Contact Plating: -; Operating Temperature Range: -20℃~+60℃
CN2 = Type-c: U262-161N-4BVC11
D6 D8-D10 = ESD9X5.0ST5G: Manufacturer: MSKSEMI(美森科); Symbol: ESD9X5.0ST5G_C3008066; Add into BOM: yes; Name: ESD9X5.0ST5G; Device: ESD9X5.0ST5G_C3008066; LCSC Part Name: ESD9X5.0ST5G; Supplier Part: C3008066; Manufacturer Part: ESD9X5.0ST5G; Supplier Footprint: SOD-923; JLCPCB Part Class: Extended Part; Datasheet: https://atta.szlcsc.com/upload/public/pdf/source/20220429/68E9B40153609821FAF30C4C48AA4713.pdf; Supplier: LCSC; Convert to PCB: yes
D7 = ESD-USB-2P: as D3 on sheet 02_MCU_PERIPHERAL; Symbol: RClamp0524PATCT; LCSC Part Name: RClamp0524PATCT; Supplier Part: C40960; Manufacturer Part: RClamp0524PATCT; Supplier Footprint: SLP2510P8; JLCPCB Part Class: Extended Part; Datasheet: https://atta.szlcsc.com/upload/public/pdf/source/20150124/1457707260739.pdf; Supplier: LCSC; Convert to PCB: yes; Operating Temperature: -55℃~+125℃@(Tj)
D11 = 1N4148W: 整流二极管; 版权归属: 源创客; BOM名称: 整流二极管; 学习资源: www.ooocke.com
LED3 = LED: BOM_Manufacturer: Wuxi ARK Tech Elec; BOM_Manufacturer Part: D-G060306G1-KS2; Contributor: LCSC; BOM_Supplier: LCSC; BOM_Supplier Part: C118334; BOM_JLCPCB Part Class: Extended Part; spicePre: L; spiceSymbolName: D-G060306G1-KS2
R25-R36 = R: as R1 on sheet 00_POWER; BOM名称: 贴片电阻
RF1 RF2 = IPEX: Manufacturer: BAT WIRELESS(蝙蝠无线); Name: BWIPX-1-001E; Add into BOM: yes; Connector Type: 板端; Interface Type: 内针; Frequency-Max: 6GHz; Number of Ports: 1; Impedance: 50Ω; Symbol: BWIPX-1-001E; Device: BWIPX-1-001E; LCSC Part Name: IPEX 内针 IPEX内针 天线座 IPEX-1 IPEX1 1代; Supplier Part: C496552; Manufacturer Part: BWIPX-1-001E; Supplier Footprint: SMD; JLCPCB Part Class: Extended Part; Datasheet: https://atta.szlcsc.com/upload/public/pdf/source/20201223/C496552_05E5A9956EAE1A8819C5051D085B1DED.pdf; Supplier: LCSC; Convert to PCB: yes; Interface Diameter: -; RF Series: IPEX; Style: -; Interface Length/Height: -; Operating Temperature Range: -
U13 = TXS0104EPWR: Manufacturer: TI(德州仪器); Add into BOM: yes; Channel Type: 双向; Number of Circuits: 1; Channels per Circuit: 4; Supply Voltage (VCCA): 1.65V~3.6V; Supply Voltage (VCCB): 2.3V~5.5V; Output Type: 推挽式；开路漏极; Data Rate: 24Mbps; Name: TXS0104EPWR; Symbol: TXS0104EPWR; Device: TXS0104EPWR; LCSC Part Name: TXS0104EPWR; Supplier Part: C44955; Manufacturer Part: TXS0104EPWR; Supplier Footprint: TSSOP-14; JLCPCB Part Class: Extended Part; Datasheet: https://www.ti.com/cn/lit/gpn/txs0104e; Supplier: LCSC; Convert to PCB: yes; Operating Temperature: -40℃~+85℃; Features: 自动方向检测

## Nets that join several sheets
AF_VDD: 00_POWER (C6.2 C13.2 C14.2 U3.5), 02_MCU_PERIPHERAL (OV1.14 OV1.21 R17.2)
AIR724_1.8V: 00_POWER (C25.2 C26.2), 03_AIR724 (U12.65), 04_AIR724_PERIPHERAL (C51.1 R30.1 U13.1 U13.8)
GND: 00_POWER (40 pins), 01_MCU (26 pins), 02_MCU_PERIPHERAL (29 pins), 03_AIR724 (19 pins), 04_AIR724_PERIPHERAL (26 pins)
P1V5: 00_POWER (C19.2 C20.2 U4.5), 02_MCU_PERIPHERAL (OV1.15)
VBUS: 03_AIR724 (U12.14), 04_AIR724_PERIPHERAL (D11.2)
VCC_3.3V#1: 00_POWER (10 pins), 01_MCU (20 pins), 02_MCU_PERIPHERAL (5 pins), 04_AIR724_PERIPHERAL (C52.2 U13.14)
VCC_5.0V#1: 00_POWER (12 pins), 02_MCU_PERIPHERAL (7 pins)
VCC_AIR724: 00_POWER (10 pins), 03_AIR724 (U12.59 U12.60), 04_AIR724_PERIPHERAL (D11.1 LED3.2)
AIR724_MODE: 03_AIR724 (U12.57), 04_AIR724_PERIPHERAL (R33.2)
AIR724_PWRKEY: 03_AIR724 (U12.68), 04_AIR724_PERIPHERAL (R35.2)
AIR724_RESET: 03_AIR724 (U12.1), 04_AIR724_PERIPHERAL (Q3.3)
AIR724_UART1_CTS: 03_AIR724 (U12.38), 04_AIR724_PERIPHERAL (U13.2)
AIR724_UART1_RTS: 03_AIR724 (U12.37), 04_AIR724_PERIPHERAL (U13.3)
AIR724_UART1_RXD: 03_AIR724 (U12.35), 04_AIR724_PERIPHERAL (U13.5)
AIR724_UART1_TXD: 03_AIR724 (U12.36), 04_AIR724_PERIPHERAL (U13.4)
FLASH_ON: 01_MCU (U6.67), 02_MCU_PERIPHERAL (R20.2)
IN_1: 01_MCU (U6.77), 02_MCU_PERIPHERAL (C10.2 R3.1 U8.4)
LTE_ANT: 03_AIR724 (U12.46), 04_AIR724_PERIPHERAL (RF1.1)
motoControl: 01_MCU (U6.60), 02_MCU_PERIPHERAL (R22.2)
OV_D0: 01_MCU (U6.63), 02_MCU_PERIPHERAL (OV1.6)
OV_D1: 01_MCU (U6.64), 02_MCU_PERIPHERAL (OV1.4)
OV_D2: 01_MCU (U6.65), 02_MCU_PERIPHERAL (OV1.3)
OV_D3: 01_MCU (U6.66), 02_MCU_PERIPHERAL (OV1.5)
OV_D4: 01_MCU (U6.3), 02_MCU_PERIPHERAL (OV1.7)
OV_D5: 01_MCU (U6.92), 02_MCU_PERIPHERAL (OV1.9)
OV_D6: 01_MCU (U6.4), 02_MCU_PERIPHERAL (OV1.11)
OV_D7: 01_MCU (U6.5), 02_MCU_PERIPHERAL (OV1.13)
OV_HREF: 01_MCU (U6.29), 02_MCU_PERIPHERAL (OV1.16)
OV_PCLK: 01_MCU (U6.31), 02_MCU_PERIPHERAL (R15.2)
OV_PWDN: 01_MCU (U6.82), 02_MCU_PERIPHERAL (OV1.17)
OV_RESET: 01_MCU (U6.81), 02_MCU_PERIPHERAL (OV1.19)
OV_SCL: 01_MCU (U6.96), 02_MCU_PERIPHERAL (OV1.20 R11.1)
OV_SDA: 01_MCU (U6.95), 02_MCU_PERIPHERAL (OV1.22 R10.1)
OV_VSYNC: 01_MCU (U6.93), 02_MCU_PERIPHERAL (OV1.18)
RGB_DATA: 01_MCU (U6.59), 02_MCU_PERIPHERAL (LED1.4)
SIM0_CLK: 03_AIR724 (U12.9), 04_AIR724_PERIPHERAL (R27.1)
SIM0_DATA: 03_AIR724 (U12.10), 04_AIR724_PERIPHERAL (R29.1)
SIM0_DET: 03_AIR724 (U12.8), 04_AIR724_PERIPHERAL (CARD1.9 R30.2)
SIM0_RST: 03_AIR724 (U12.11), 04_AIR724_PERIPHERAL (R26.1)
SIM0_VCC: 03_AIR724 (U12.12), 04_AIR724_PERIPHERAL (C46.1 C47.1 CARD1.1 D6.1)
STM32_AIR724_RESET: 01_MCU (U6.7), 04_AIR724_PERIPHERAL (R32.2)
STM32_UART1_CTS: 01_MCU (U6.69), 04_AIR724_PERIPHERAL (U13.12)
STM32_UART1_RTS: 01_MCU (U6.68), 04_AIR724_PERIPHERAL (U13.13)
STM32_UART1_RXD: 01_MCU (U6.70), 04_AIR724_PERIPHERAL (U13.11)
STM32_UART1_TXD: 01_MCU (U6.71), 04_AIR724_PERIPHERAL (U13.10)
SWCLK: 01_MCU (U6.76), 02_MCU_PERIPHERAL (U14.2)
SWDIO: 01_MCU (U6.72), 02_MCU_PERIPHERAL (U14.3)
USB1_D+: 01_MCU (U6.54), 02_MCU_PERIPHERAL (CN1.A6 CN1.B6 D3.2 D3.9)
USB1_D-: 01_MCU (U6.53), 02_MCU_PERIPHERAL (CN1.A7 CN1.B7 D3.1 D3.10)
WIFI_ANT: 03_AIR724 (U12.34), 04_AIR724_PERIPHERAL (RF2.1)